# EAGLE schematic control (EAGLE 9.3.2)

## Sheet 1 of 3: MCU
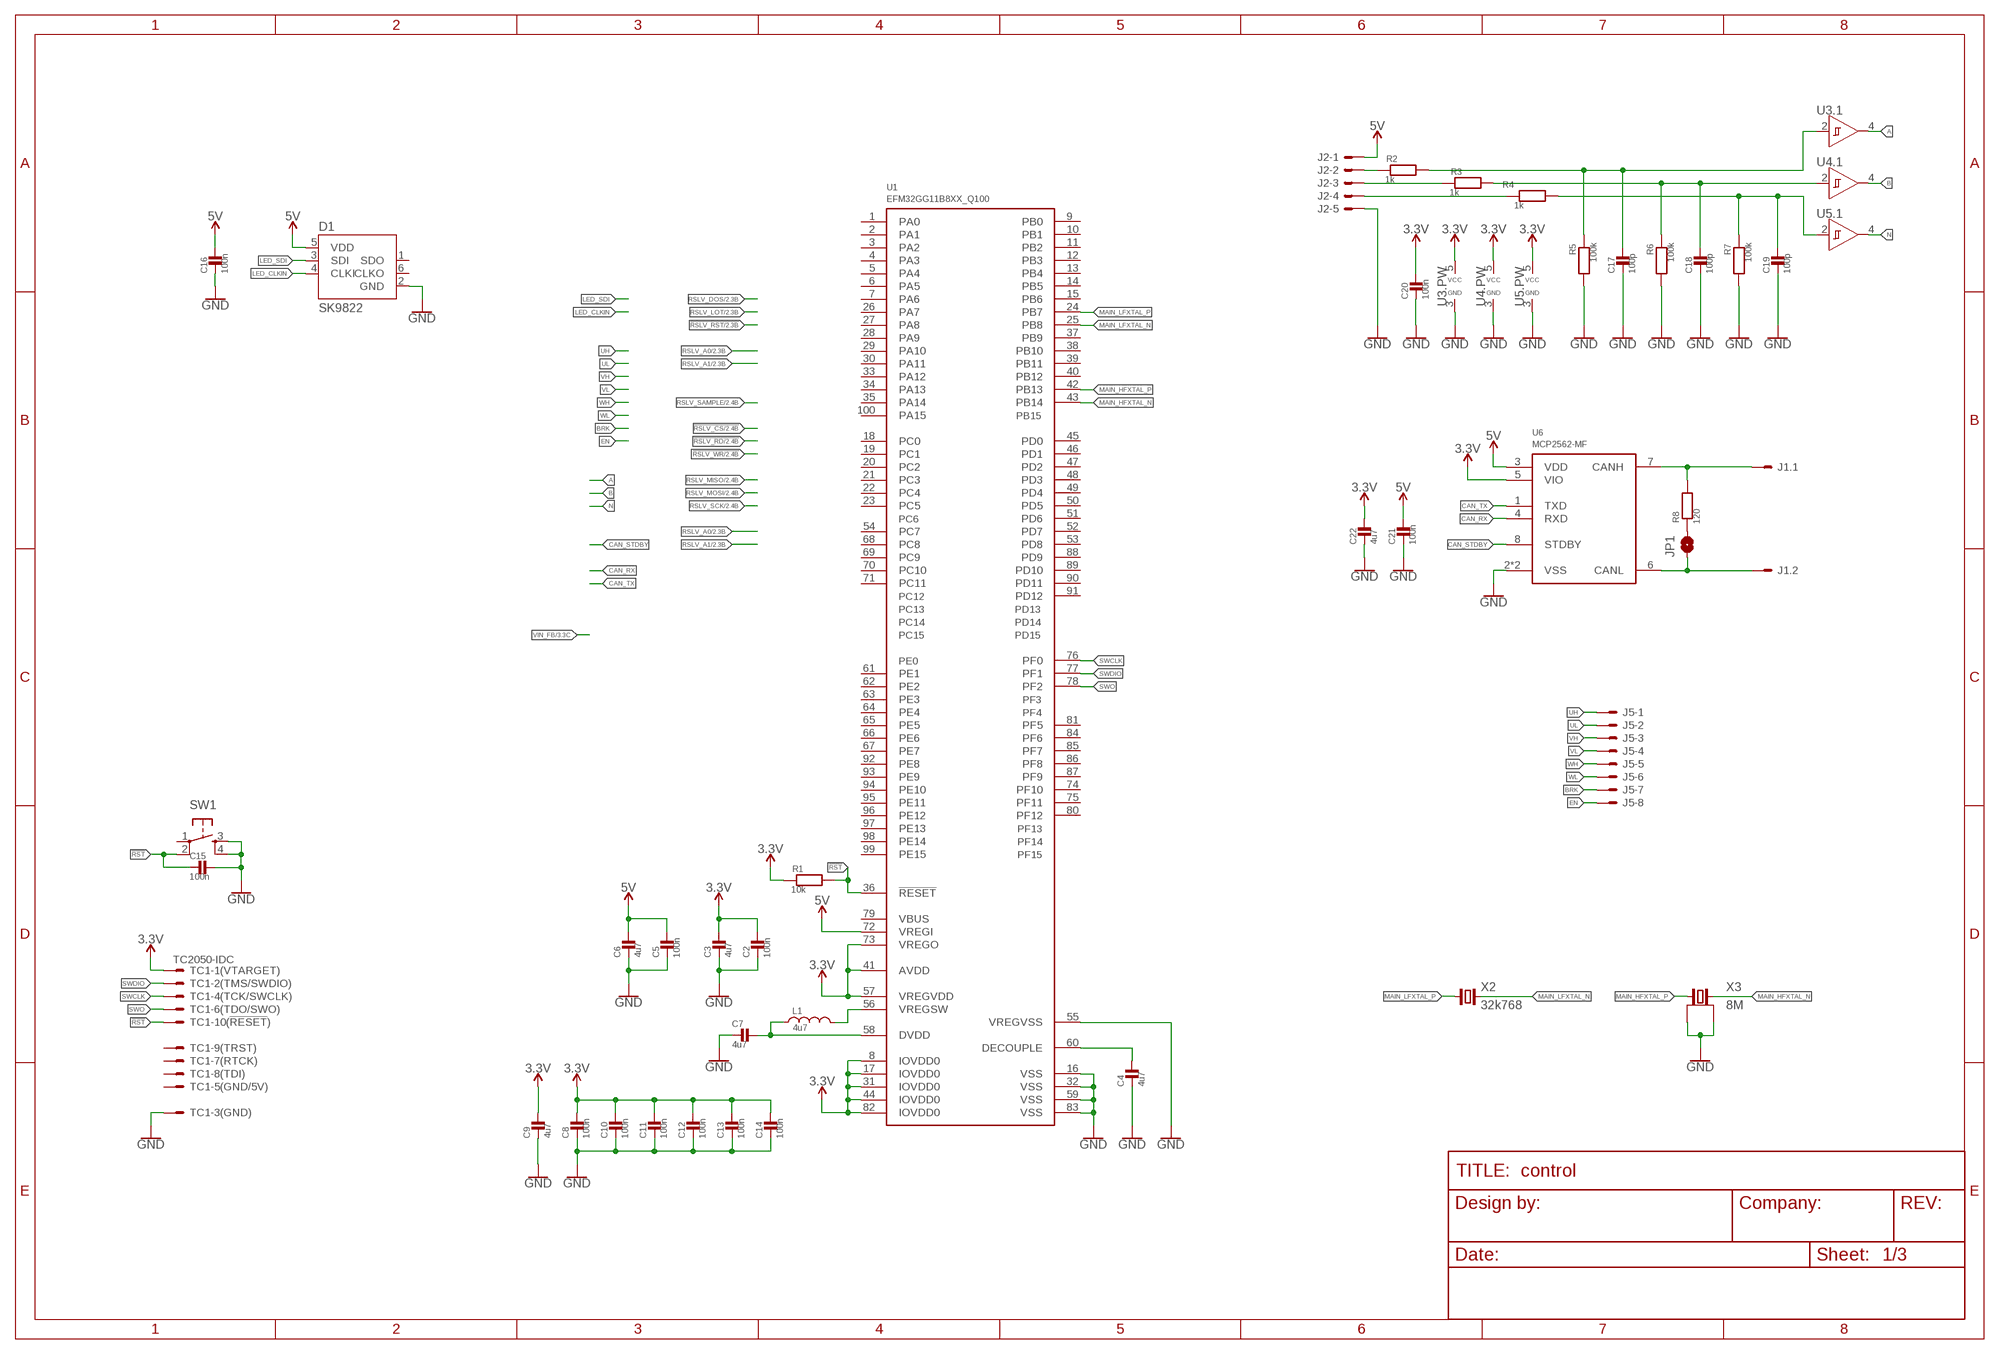
[diagram p0: schematic, sheet 1]

### Parts
C2  100n  MLCC0603  [0603_WAVE]
C3  4u7  MLCC0603  [0603_WAVE]
C4  4u7  MLCC0603  [0603_WAVE]
C5  100n  MLCC0603  [0603_WAVE]
C6  4u7  MLCC0603  [0603_WAVE]
C7  4u7  MLCC0603  [0603_WAVE]
C8  100n  MLCC0603  [0603_WAVE]
C9  4u7  MLCC0603  [0603_WAVE]
C10  100n  MLCC0603  [0603_WAVE]
C11  100n  MLCC0603  [0603_WAVE]
C12  100n  MLCC0603  [0603_WAVE]
C13  100n  MLCC0603  [0603_WAVE]
C14  100n  MLCC0603  [0603_WAVE]
C15  100n  MLCC0603  [0603_WAVE]
C16  100n  MLCC0603  [0603_WAVE]
C17  100p  MLCC0603  [0603_WAVE]
C18  100p  MLCC0603  [0603_WAVE]
C19  100p  MLCC0603  [0603_WAVE]
C20  100n  MLCC0603  [0603_WAVE]
C21  100n  MLCC0603  [0603_WAVE]
C22  4u7  MLCC0603  [0603_WAVE]
D1  SK9822  [2020]
J1  2EDG-2P  [2EDG-2P]
J2  5  [1X5_2.54]
J5  8  [1X8_2.54]
JP1  JUMPER-SMT_2_NO_NO-SILK  [SMT-JUMPER_2_NO_NO-SILK]
L1  4u7  INDUCTOR_NC_0806  [_0806]
R1  10k  RESISTOR0603  [0603_WAVE]
R2  1k  RESISTOR0603  [0603_WAVE]
R3  1k  RESISTOR0603  [0603_WAVE]
R4  1k  RESISTOR0603  [0603_WAVE]
R5  100k  RESISTOR0603  [0603_WAVE]
R6  100k  RESISTOR0603  [0603_WAVE]
R7  100k  RESISTOR0603  [0603_WAVE]
R8  120  RESISTOR0603  [0603_WAVE]
SW1  PUSH_BUTTON  [PUSH_BUTTON]
TC1  TC2050-IDC  [TC2050-IDC]
U1  EFM32GG11B8XX_Q100  [QFP100]
U3  74LVC1G17  [SC70-5]
U4  74LVC1G17  [SC70-5]
U5  74LVC1G17  [SC70-5]
U6  MCP2562-MF  [DFN8]
X2  32k768  CRYSTAL2-SMD-3215  [2-SMD-3215]
X3  8M  CRYSTAL_4P  [4-SMD-3225]

### Nets
3.3V: C2.P$1 C3.P$1 C8.P$1 C9.P$1 C10.P$1 C11.P$1 C12.P$1 C13.P$1 C14.P$1 C20.P$1 C22.P$1 R1.P$1 TC1.1 U1.8(IOVDD0) U1.17(IOVDD0) U1.31(IOVDD0) U1.41(AVDD) U1.44(IOVDD0) U1.57(VREGVDD) U1.73(VREGO) U1.82(IOVDD0) U3.5(.PW:VCC) U4.5(.PW:VCC) U5.5(.PW:VCC) U6.5(VIO) ; also sheet 2
5V: C5.P$1 C6.P$1 C16.P$1 C21.P$1 D1.5(VDD) J2.1 U1.72(VREGI) U6.3(VDD) ; also sheet 2,3
!RST: C15.P$2 R1.P$2 SW1.2 TC1.10 U1.36(!RESET)
A: U3.4(.1:Y)
B: U4.4(.1:Y)
BRK: J5.7
CAN_RX: U6.4(RXD)
CAN_STDBY: U6.8(STDBY)
CAN_TX: U6.1(TXD)
EN: J5.8
GND: C2.P$2 C3.P$2 C4.P$2 C5.P$2 C6.P$2 C7.P$2 C8.P$2 C9.P$2 C10.P$2 C11.P$2 C12.P$2 C13.P$2 C14.P$2 C15.P$1 C16.P$2 C17.P$2 C18.P$2 C19.P$2 C20.P$2 C21.P$2 C22.P$2 D1.2(GND) J2.5 R5.P$2 R6.P$2 R7.P$2 SW1.3 SW1.4 TC1.3 U1.16(VSS) U1.32(VSS) U1.55(VREGVSS) U1.59(VSS) U1.83(VSS) U3.3(.PW:GND) U4.3(.PW:GND) U5.3(.PW:GND) U6.2(VSS) U6.9(VSS) X3.2(GND) X3.4(GND) ; also sheet 2,3
LED_CLKIN: D1.4(CLKI)
LED_SDI: D1.3(SDI)
MAIN_HFXTAL_N: U1.43(PB14) X3.3
MAIN_HFXTAL_P: U1.42(PB13) X3.1
MAIN_LFXTAL_N: U1.25(PB8) X2.2
MAIN_LFXTAL_P: U1.24(PB7) X2.1
N: U5.4(.1:Y)
N$1: J2.2 R2.P$1
N$2: L1.2 U1.56(VREGSW)
N$3: J2.3 R3.P$1
N$4: C7.P$1 L1.1 U1.58(DVDD)
N$5: J2.4 R4.P$1
N$6: C17.P$1 R2.P$2 R5.P$1 U3.2(.1:A)
N$7: C4.P$1 U1.60(DECOUPLE)
N$8: C18.P$1 R3.P$2 R6.P$1 U4.2(.1:A)
N$9: C19.P$1 R4.P$2 R7.P$1 U5.2(.1:A)
N$10: J1.P$1 R8.P$2 U6.7(CANH)
N$11: J1.P$2 JP1.1 U6.6(CANL)
N$12: JP1.2 R8.P$1
SWCLK: TC1.4 U1.76(PF0)
SWDIO: TC1.2 U1.77(PF1)
SWO: TC1.6 U1.78(PF2)
UH: J5.1
UL: J5.2
VH: J5.3
VL: J5.4
WH: J5.5
WL: J5.6
Unconnected: D1.1(SDO) D1.6(CLKO) SW1.1 TC1.5 TC1.7 TC1.8 TC1.9 U1.1(PA0) U1.2(PA1) U1.3(PA2) U1.4(PA3) U1.5(PA4) U1.6(PA5) U1.7(PA6) U1.9(PB0) U1.10(PB1) U1.11(PB2) U1.12(PB3) U1.13(PB4) U1.14(PB5) U1.15(PB6) U1.18(PC0) U1.19(PC1) U1.20(PC2) U1.21(PC3) U1.22(PC4) U1.23(PC5) U1.26(PA7) U1.27(PA8) U1.28(PA9) U1.29(PA10) U1.30(PA11) U1.33(PA12) U1.34(PA13) U1.35(PA14) U1.37(PB9) U1.38(PB10) U1.39(PB11) U1.40(PB12) U1.45(PD0) U1.46(PD1) U1.47(PD2) U1.48(PD3) U1.49(PD4) U1.50(PD5) U1.51(PD6) U1.52(PD7) U1.53(PD8) U1.54(PC7) U1.61(PE1) U1.62(PE2) U1.63(PE3) U1.64(PE4) U1.65(PE5) U1.66(PE6) U1.67(PE7) U1.68(PC8) U1.69(PC9) U1.70(PC10) U1.71(PC11) U1.74(PF10) U1.75(PF11) U1.79(VBUS) U1.80(PF12) U1.81(PF5) U1.84(PF6) U1.85(PF7) U1.86(PF8) U1.87(PF9) U1.88(PD9) U1.89(PD10) U1.90(PD11) U1.91(PD12) U1.92(PE8) U1.93(PE9) U1.94(PE10) U1.95(PE11) U1.96(PE12) U1.97(PE13) U1.98(PE14) U1.99(PE15) U1.100(PA15)

## Sheet 2 of 3: Resolver
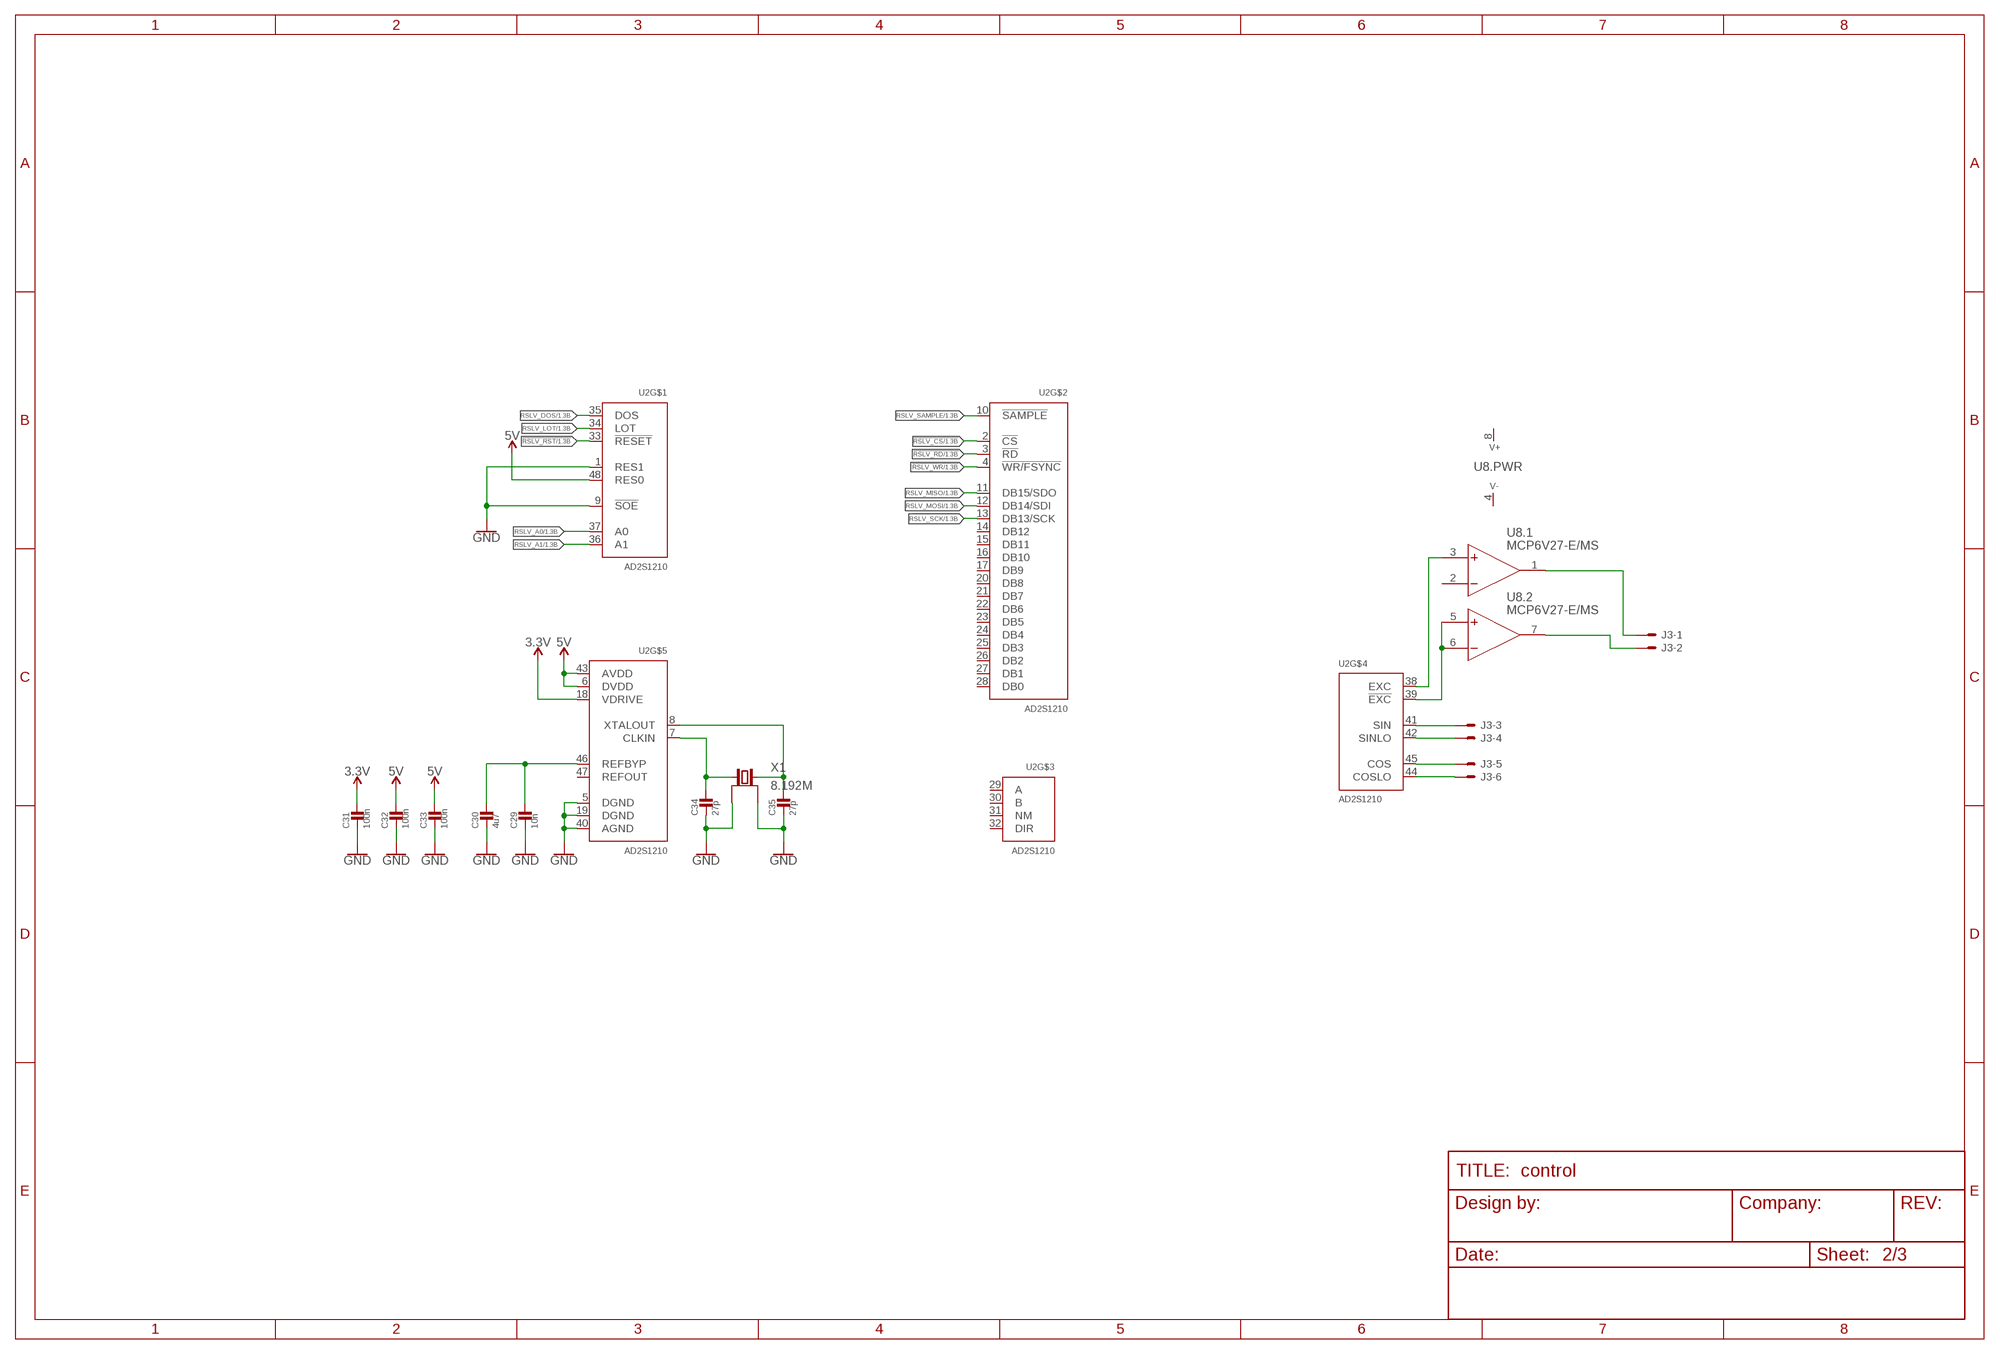
[diagram p1: schematic, sheet 2]

### Parts
C29  10n  MLCC0603  [0603_WAVE]
C30  4u7  MLCC0603  [0603_WAVE]
C31  100n  MLCC0603  [0603_WAVE]
C32  100n  MLCC0603  [0603_WAVE]
C33  100n  MLCC0603  [0603_WAVE]
C34  27p  MLCC0603  [0603_WAVE]
C35  27p  MLCC0603  [0603_WAVE]
J3  6  [1X6_2.54]
U2  AD2S1210  [QFP64]
U8  MCP6V27-E/MS  [MSOP-8]
X1  8.192M  CRYSTAL_4P  [4-SMD-3225]

### Nets
3.3V: C31.P$1 U2.18(VDRIVE) ; also sheet 1
5V: C32.P$1 C33.P$1 U2.6(DVDD) U2.43(AVDD) U2.48(RES0) ; also sheet 1,3
!RSLV_CS: U2.2(!CS) ; also sheet 1
!RSLV_RD: U2.3(!RD) ; also sheet 1
!RSLV_RST: U2.33(!RESET) ; also sheet 1
!RSLV_WR: U2.4(!WR/FSYNC) ; also sheet 1
GND: C29.P$2 C30.P$2 C31.P$2 C32.P$2 C33.P$2 C34.P$2 C35.P$2 U2.1(RES1) U2.5(DGND) U2.9(!SOE) U2.19(DGND) U2.40(AGND) X1.2(GND) X1.4(GND) ; also sheet 1,3
N$15: J3.3 U2.41(SIN)
N$17: J3.4 U2.42(SINLO)
N$20: J3.5 U2.45(COS)
N$21: J3.6 U2.44(COSLO)
N$22: U2.38(EXC) U8.3(.1:+IN)
N$23: J3.1 U8.1(.1:OUT)
N$24: U2.39(!EXC) U8.5(.2:+IN) U8.6(.2:-IN)
N$25: J3.2 U8.7(.2:OUT)
N$26: C34.P$1 U2.7(CLKIN) X1.1
N$27: C35.P$1 U2.8(XTALOUT) X1.3
N$30: C29.P$1 C30.P$1 U2.46(REFBYP)
RSLV_A0: U2.37(A0) ; also sheet 1
RSLV_A1: U2.36(A1) ; also sheet 1
RSLV_DOS: U2.35(DOS) ; also sheet 1
RSLV_LOT: U2.34(LOT) ; also sheet 1
RSLV_MISO: U2.11(DB15/SDO) ; also sheet 1
RSLV_MOSI: U2.12(DB14/SDI) ; also sheet 1
RSLV_SAMPLE: U2.10(!SAMPLE) ; also sheet 1
RSLV_SCK: U2.13(DB13/SCK) ; also sheet 1
Unconnected: U2.14(DB12) U2.15(DB11) U2.16(DB10) U2.17(DB9) U2.20(DB8) U2.21(DB7) U2.22(DB6) U2.23(DB5) U2.24(DB4) U2.25(DB3) U2.26(DB2) U2.27(DB1) U2.28(DB0) U2.29(A) U2.30(B) U2.31(NM) U2.32(DIR) U2.47(REFOUT) U8.2(.1:-IN)

## Sheet 3 of 3: Power
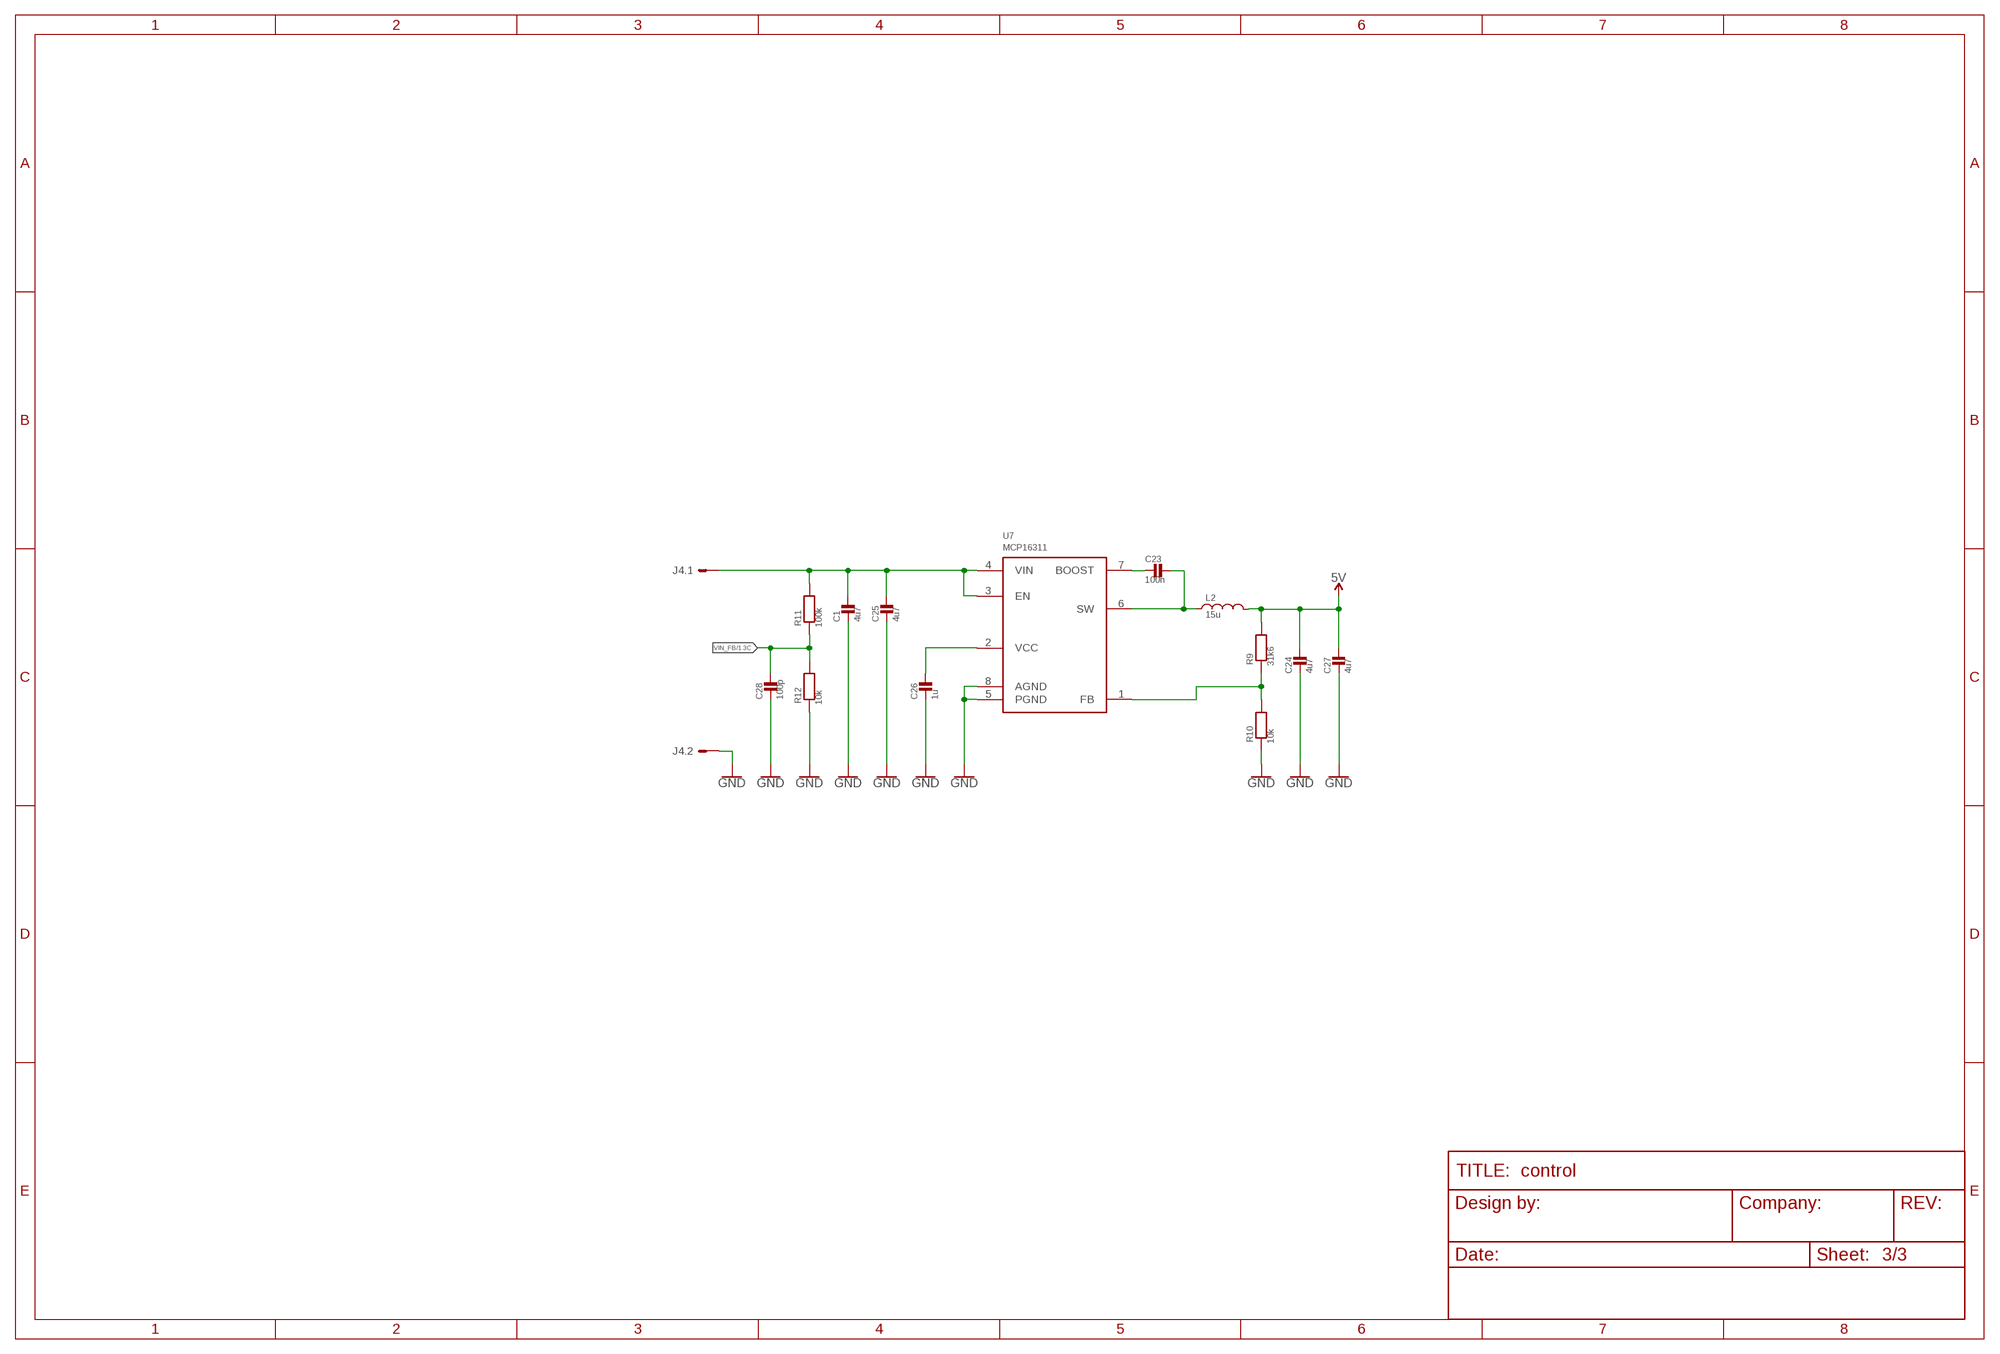
[diagram p2: schematic, sheet 3]

### Parts
C1  4u7  MLCC0603  [0603_WAVE]
C23  100n  MLCC0603  [0603_WAVE]
C24  4u7  MLCC0603  [0603_WAVE]
C25  4u7  MLCC0603  [0603_WAVE]
C26  1u  MLCC0603  [0603_WAVE]
C27  4u7  MLCC0603  [0603_WAVE]
C28  100p  MLCC0603  [0603_WAVE]
J4  2EDG-2P  [2EDG-2P]
L2  15u  INDUCTOR_NC_0806  [_0806]
R9  31k6  RESISTOR0603  [0603_WAVE]
R10  10k  RESISTOR0603  [0603_WAVE]
R11  100k  RESISTOR0603  [0603_WAVE]
R12  10k  RESISTOR0603  [0603_WAVE]
U7  MCP16311  [MSOP8]

### Nets
5V: C24.P$1 C27.P$1 L2.2 R9.P$2 ; also sheet 1,2
GND: C1.P$2 C24.P$2 C25.P$2 C26.P$2 C27.P$2 C28.P$2 J4.P$2 R10.P$1 R12.P$1 U7.5(PGND) U7.8(AGND) ; also sheet 1,2
N$13: C23.P$2 U7.7(BOOST)
N$14: C23.P$1 L2.1 U7.6(SW)
N$16: R9.P$1 R10.P$2 U7.1(FB)
N$18: C26.P$1 U7.2(VCC)
N$19: C1.P$1 C25.P$1 J4.P$1 R11.P$2 U7.3(EN) U7.4(VIN)
VIN_FB: C28.P$1 R11.P$1 R12.P$2 ; also sheet 1

## Power pins joined to a net without a drawn wire
V+: U8.8(.PWR:V+)
V-: U8.4(.PWR:V-)

## Library data of the parts
C1-C35 = Passive Components > Capacitors > Multilayer Ceramic Capacitors MLCC:MLCC: KEMET’s X7R dielectric features a 125°C maximum operating temperature and is considered temperature stable. The Electronics Components, Assemblies and Materials Association (EIA) characterizes X7R dielectric as a Class II material. Components of this classification are fixed, ceramic dielectric capacitors suited for bypass and decoupling applications or for frequency discriminating circuits where Q and stability of capacitance characteristics are not critical. X7R exhibits a predictable change in capacitance with respect to time and voltage, boasting a minimal change in capacitance with reference to ambient temperature. Capacitance change is limited to ±15% from −55°C to +125°C.
D1 = Opto-electronics > LED Emitters:SK9822
J1 J4 = Connectors > Other:2EDG-2P
J2 = Connectors > Header:5
J3 = Connectors > Header:6
J5 = Connectors > Header:8
JP1 = Utility > Board:JUMPER-SMT_2_NO: Normally open jumper This jumper has two pads in close proximity to each other. Apply solder to close the connection. Round pads are easier to solder for beginners, but are a lot larger. SparkFun Product that uses the round pads: SparkFun EL Sequencer <https://www.sparkfun.com/products/12781>
L1 L2 = Passive Components > Inductors, Chokes & Coils:INDUCTOR_NC
R1-R12 = Passive Components > Resistors > Chip Resistors:RESISTOR: Resistors For new designs, use the packages preceded by an '_' character since they are more reliable: The following footprints should be used on most boards: _0402 - Standard footprint for regular board layouts _0603 - Standard footprint for regular board layouts _0805 - Standard footprint for regular board layouts _1206 - Standard footprint for regular board layouts For extremely tight-pitch boards where space is at a premium, the following 'micro-pitch' footprints can be used (smaller pads, no silkscreen outline, etc.): _0402MP - Micro-pitch footprint for very dense/compact boards _0603MP - Micro-pitch footprint for very dense/compact boards _0805MP - Micro-pitch footprint for very dense/compact boards _1206MP - Micro-pitch footprint for very dense/compact boards
SW1 = Eletromechanical > Switches > Tactile Switches:PUSH_BUTTON
TC1 = Connectors > Other:TC2050-IDC
U1 = Semiconductors > Embedded Processors & Controllers > Microcontrollers - MCU:EFM32GG11B8XX_Q100
U2 = Semiconductors > Integrated Circuits - ICs > Syncro_Resolver to Digital:AD2S1210
U3-U5 = Semiconductors > Integrated Circuits - ICs > Logic ICs > Logic Gates:74LVC1G17
U6 = Semiconductors > Integrated Circuits - ICs > Interface ICs > CAN Interface IC:MCP2562
U7 = Power > Switching Controllers:MCP1631*
U8 = Semiconductors > Integrated Circuits - ICs > Amplifier ICs > Operational Amplifiers - Op Amps:MCP6V27
X1 X3 = Passive Components > Frequency Control & Timing Devices > Crystals:CRYSTAL_4P
X2 = Passive Components > Frequency Control & Timing Devices > Crystals:CRYSTAL